# EAGLE design Adafruit MicroLipo (EAGLE 6.3)
AUTHOR: K. TOWNSEND
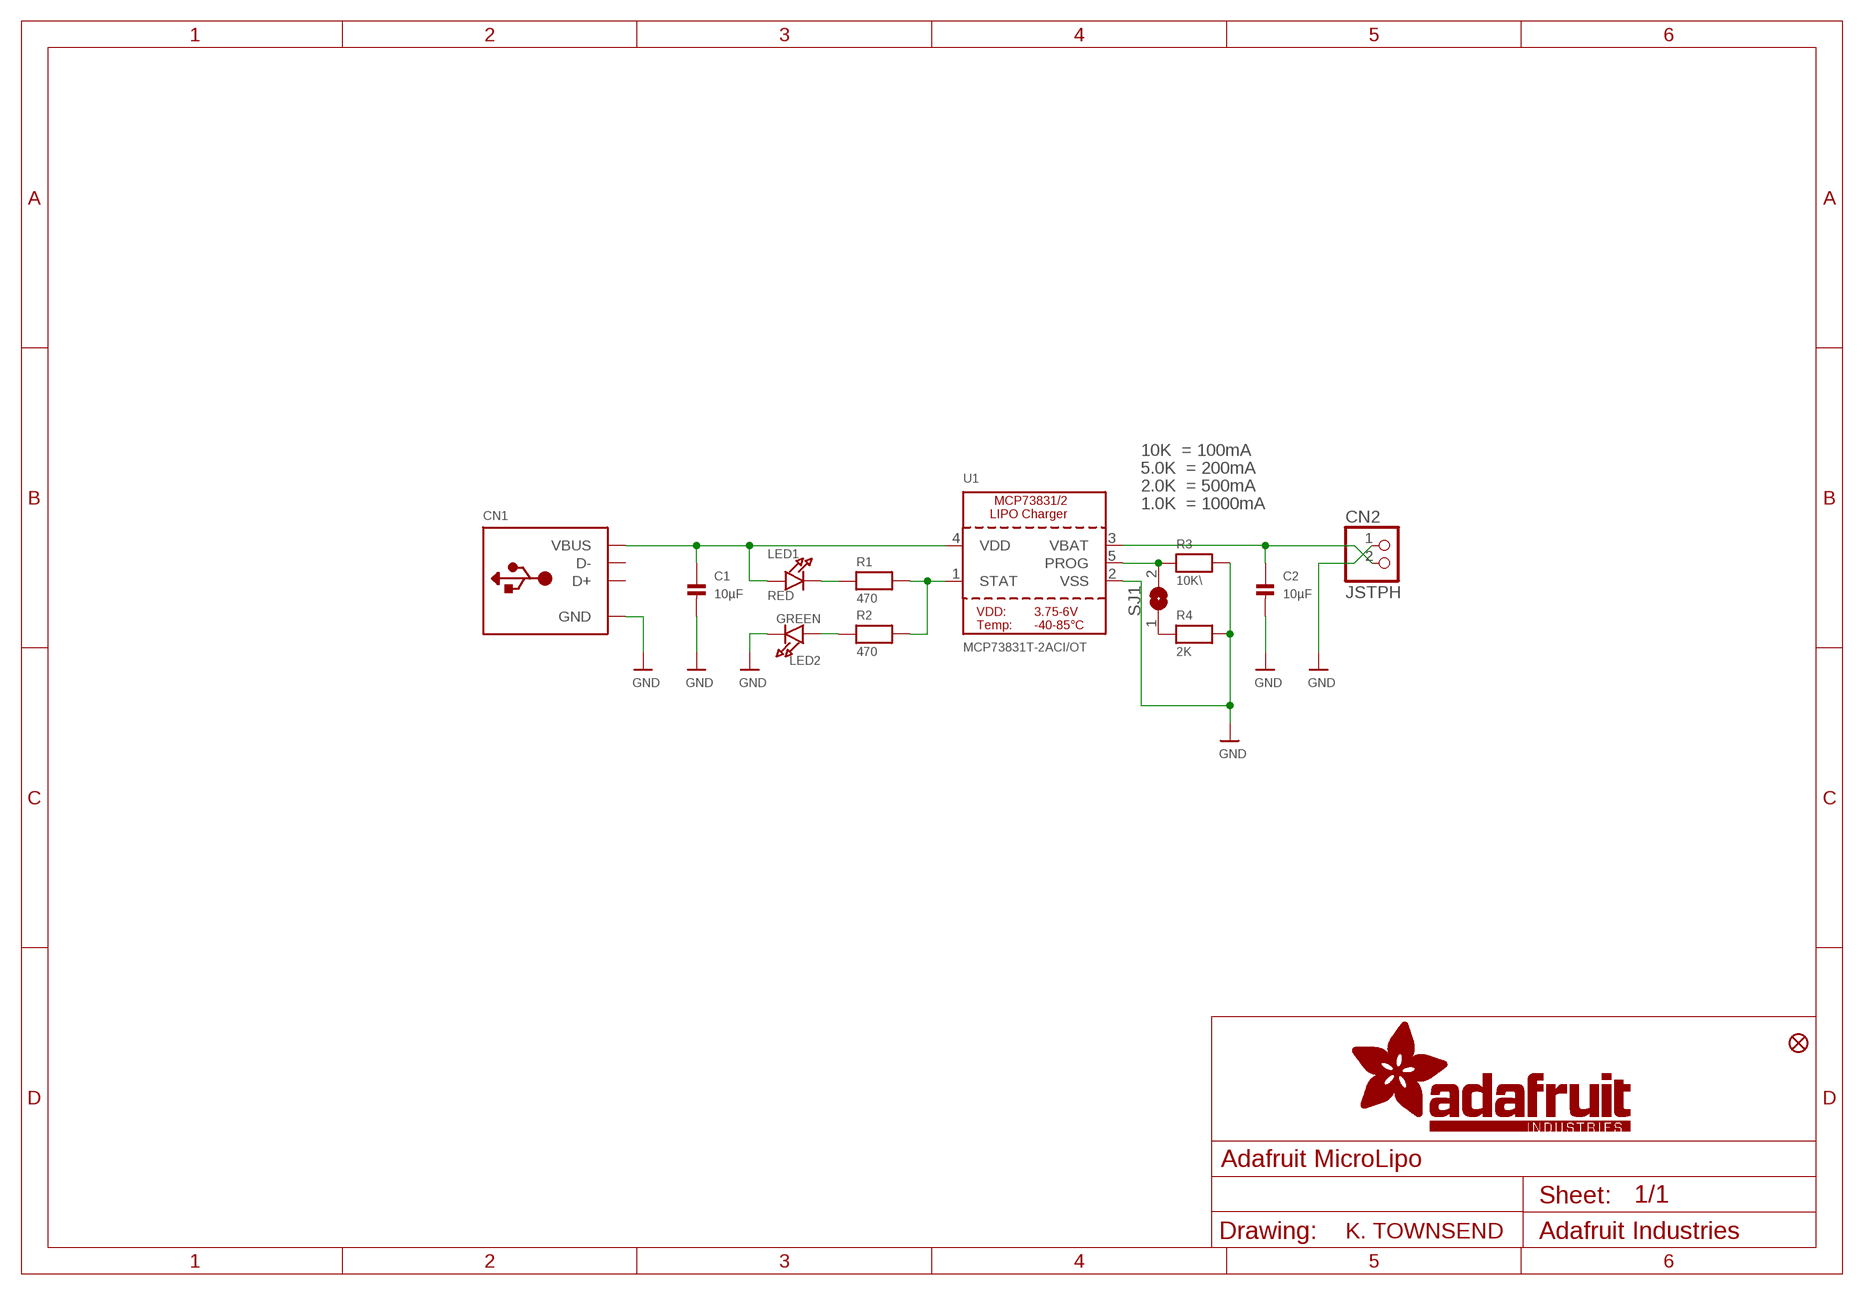
[diagram p0: schematic, sheet 1]

## Parts
C1  10µF  CAP_CERAMIC0805  [0805]
C2  10µF  CAP_CERAMIC0805  [0805]
CN1  USB_TYPEAPCB  [USBA_PCB]
CN2  JSTPH  JST_2PIN  [JSTPH2]
FID1  FIDUCIAL""  [FIDUCIAL_1MM]
LED1  RED  LED0805  [CHIPLED_0805]
LED2  GREEN  LED0805  [CHIPLED_0805]
R1  470  RESISTOR0805  [0805]
R2  470  RESISTOR0805  [0805]
R3  10K\  RESISTOR0805  [0805]
R4  2K  RESISTOR0805  [0805]
SJ1  SOLDERJUMPER  [SOLDERJUMPER_ARROW_NOPASTE]
U1  MCP73831T-2ACI/OT  MCP73831/2  [SOT23-5]

## Nets
GND: C1.2 C2.2 CN1.GND CN2.1 LED2.C R3.2 R4.2 U1.2(VSS)
N$1: LED1.C R1.1
N$2: R1.2 R2.2 U1.1(STAT)
N$3: R4.1 SJ1.1
N$5: R3.1 SJ1.2 U1.5(PROG)
N$6: LED2.A R2.1
VBAT: C2.1 CN2.2 U1.3(VBAT)
VDD: C1.1 CN1.VCC(VBUS) LED1.A U1.4(VDD)
Unconnected: CN1.USB_NEG(D-) CN1.USB_PLUS(D+)

## Notes on the sheet
- 10K  = 100mA
- 5.0K  = 200mA
- 2.0K  = 500mA
- 1.0K  = 1000mA

## Library data of the parts
C1 C2 = microbuilder:CAP_CERAMIC: Ceramic Capacitors 0402 - 0402 Surface Mount Capacitors 16pF 50V 5% [Digikey: 445-4899-2-ND] 18pF 50V 5% [Digikey: 490-1281-2-ND] 22pF 50V 5% [Digikey: 490-1283-2-ND] 68pF 50V 5% [Digikey: 490-1289-2-ND] 0.1uF 10V 10% [Digikey: 490-1318-2-ND] 1.0uF 6.3V 10% [Digikey: 490-1320-2-ND] 0603 - 0603 Surface Mount Capacitors 16 pF 50V 5% [Digikey: 445-5051-2-ND] 22 pF 50V [Digikey: PCC220ACVTR-ND] 33 pF 50V 5% [Digikey: 490-1415-1-ND] 56pF 50V 5% [Digikey: 490-1421-1-ND] 220pF 50V 5% [Digikey: 445-1285-1-ND] 680 pF 50V 2200 pF 50V 5% C0G [Digikey: 445-1297-1-ND] 5600 pF 100V 5% X7R [Digikey: 478-3711-1-ND] 0.1 µF 25V 10% [Digikey: PCC2277TR-ND] 0.22 µF 16V 10% X7R [Digikey: 445-1318-1-ND] 1.0 µF 25V 10% [Digikey: 445-5146-2-ND] 0603 - RF Specific 3pF 250V +/-0.1pF RF [Digikey: 712-1347-1-ND] 18 pF 250V 5% [Digikey: 478-3505-1-ND or 712-1322-1-ND] 56 pF 250V 5% C0G RF [Digikey: 490-4867-1-ND] 68 pF 250V RF [Digikey: 490-4868-1-ND] 0805 - 0805 Surface Mount Capacitors 220 pF 250V 2% RF Ceramic Capacitor [Digikey: 712-1398-1-ND] 1000 pF 50V 2% NP0 Ceramic Capacitor [Digikey: 478-3760-1-ND] 0.1 µF 25V 10% Ceramic Capacitor [Digikey: PCC1828TR-ND] 1.0 µF 16V 10% Ceramic Capacitor[Digikey: 490-1691-2-ND] 10.0 µF 10V 10% Ceramic Capacitor[Digikey: 709-1228-1-ND] 10.0 uF 16V 10% Ceramic Capacitor [Digikey: 478-5165-2-ND] 47 uF 6.3V 20% Ceramic Capacitor [Digikey: 587-1779-1-ND or 399-5506-1-ND] 1206 - 1206 Surface Mount Capacitors 47uF 10V 20% Ceramic Capacitor [Digikey: 490-5528-1-ND or 399-5508-1-ND or 445-6010-1-ND] 100uF 6.3V -20%, +80% Y5V Ceramic Capacitor (Digikey: 490-4512-1-ND, Mouser: 81-GRM31CF50J107ZE1L)
CN1 = microbuilder:USB_TYPEA: USB - Type A Connectors Male types stick out and are inserted into a PC or matching females parts (these are the connectors used on USB Memory Sticks, etc.). Female parts are generally used for USB Host and accept a male-type connector. SMT Male - 4UCON: 10017 PTH Female - Digikey: 609-1045-ND, 4UCon: 05241
CN2 = microbuilder:JST_2PIN: JST 2-Pin Right-Angle Connector PH-Series - 4UConnector: 17311 SH-Series - 4UConnector: 07278
FID1 = microbuilder:FIDUCIAL: Fiducial Alignment Points Various fiducial points for machine vision alignment.
LED1 LED2 = microbuilder:LED: LED 0603 - 0603 Surface Mount Package 2mA: Green LED - Low Power (3.9mcd, 2ma, 1.7Vf) - Digikey: 475-2709-2-ND Orange LED - Low Power (9.8mcd, 2ma, 1.8Vf) - Digikey: 475-1194-2-ND Red LED - Low Power (5mcd, 2ma, 1.8Vf) - Digikey: 475-1195-2-ND Yellow LED - Low Power (7mcd, 2ma, 1.8Vf) - Digikey: 475-1196-2-ND 5mA: Blue LED - Low Power (17mcd, 5ma, 2.9Vf) - Digikey: LNJ937W8CRACT-ND 0805 - 0805 Surface Mount Package 2mA: Red LED (8.8mcd, 2mA, 1.8Vf, Clear) - Low Power [Digikey: 475-2510-1-ND] Green LED (5mcd, 2mA, 1.8Vf, Clear) - Low Power [Digikey: 475-2730-1-ND] Yellow LED (11.3mcd, 2mA, 1.8Vf, Clear) - Low Power [Digikey: 475-2555-1-ND] 20mA: Red LED (104mcd, 20mA, Diffused) - LS R976 [Digikey: 475-1278-6-ND] Red LED (12mcd, 20mA, 2.0Vf, Clear) - APT2012EC [Digikey: 754-1128-1-ND] Green LED (15mcd, 20mA, 2.2Vf, Clear) - APT2012GC [Digikey: 754-1131-1-ND] Orange LED (160mcd, 20mA, 2.1Vf, Clear) - APT2012SECK [Digikey: 754-1130-1-ND] 1206 - 1206 Surface Mount Package Green LED (26mcd, 20mA, Diffused) - LG N971 [Digikey: 475-1407-6-ND] Red LED (15mcd, 20mA, Diffused) - LH N974 [Digikey: 475-1416-6-ND] Cree - Cree High-Power Surface Mount LEDs XPEBWT-L1-0000-00D50 - White 111lm 350mA 2.9Vf 6200K 110° XTEAWT-00-0000-00000LEE3 - White 114lm 350mA 2.85Vf 5000K 115°
R1-R4 = microbuilder:RESISTOR: Resistors 0402 - 0402 Surface Mount Package 22 Ohm 1% 1/16W [Digikey: 311-22.0LRTR-ND] 33 Ohm 5% 1/16W 1.0K 5% 1/16W 1.5K 5% 1/16W 2.0K 1% 1/16W 10.0K 1% 1/16W [Digikey: 311-10.0KLRTR-ND] 10.0K 5% 1/16W [Digikey: RMCF0402JT10K0TR-ND] 12.1K 1% 1/16W [Digikey: 311-22.0LRTR-ND] 100.0K 5% 1/16W 0603 - 0603 Surface Mount Package 0 Ohm 1/10 Watt 1% Resistor 15 Ohm 1/10 Watt 1% Resistor 33 Ohm 1/10 Watt 1% Resistor 49.9 Ohm 1/10 Watt 1% Resistor 100 Ohm 1/10 Watt 1% Resistor 150 Ohm 1/10 Watt 1% Resistor 240 Ohm 1/10 Watt 1% Resistor 390 Ohm 1/10 Watt 1% Resistor 560 Ohm 1/10 Watt 1% Resistor 680 Ohm 1/10 Watt 1% Resistor 750 Ohm 1/10 Watt 1% Resistor 1.0K Ohm 1/10 Watt 1% Resistor 1.5K Ohm 1/10 Watt 1% Resistor 2.0K Ohm 1/10 Watt 1% Resistor 2.2K Ohm 1/10 Watt 1% Resistor 3.3K Ohm 1/10 Watt 1% Resistor 4.7K Ohm 1/10 Watt 1% Resistor 10.0K Ohm 1/10 Watt 1% Resistor 12.0K Ohm 1/10 Watt 1% Resistor 12.1K Ohm 1/10 Watt 1% Resistor 20.0K Ohm 1/10 Watt 1% Resistor 33.0K Ohm 1/10 Watt 1% Resistor 100.0K Ohm 1/10 Watt 1% Resistor 0805 - 0805 Surface Mount Package 0 Ohm 1/8 Watt 1% Resistor 33 Ohm 1/8 Watt 1% Resistor 100 Ohm 1/8 Watt 1% Resistor 150 Ohm 1/8 Watt 1% Resistor 200 Ohm 1/8 Watt 1% Resistor 240 Ohm 1/8 Watt 1% Resistor 330 Ohm 1/8 Watt 1% Resistor 390 Ohm 1/8 Watt 1% Resistor 470 Ohm 1/8 Watt 1% Resistor 1.0K Ohm 1/8 Watt 1% Resistor 1.5K Ohm 1/8 Watt 1% Resistor 2.0K Ohm 1/8 Watt 1% Resistor 4.7K Ohm 1/8 Watt 1% Resistor 5.1K Ohm 1/8 Watt 1% Resistor 5.6K Ohm 1/8 Watt 1% Resistor 10.0K Ohm 1/8 Watt 1% Resistor 22.0K Ohm 1/8 Watt 1% Resistor 33.0K Ohm 1/8 Watt 1% Resistor 100K Ohm 1/8 Watt 1% Resistor 1206 - 1206 Surface Mount Package 2012 - 2010 Surface Mount Package 0.11 Ohm 1/2 Watt 1% Resistor - Digikey: RHM.11UCT-ND
SJ1 = microbuilder:SOLDERJUMPER: SMD Solder JUMPER Solder the two pads together to create a connection, or remove the solder to break it. REFLOW - Use this footprint for solder paste and reflow ovens. WAVE - Use this footprint for hand-soldering (larger pads). CLOSED - Has a trace between the two pads to ensure it is closed by default. The trace needs to be cut to disable the jumper, and can be closed again by creating a solder bridge between the two pads.; BOM: EXCLUDE
U1 = microbuilder:MCP73831/2: MCP73831/2 LIPO Charger VDD: 3.75 - 6V Temp -40 - 85°C Programmable Charge Rate: 15-500mA NOTE: STAT is a tri-state logic output on the MCP73831 and an open-drain output on the MCP73832. SOT23-5 with 4.2V output and tri-state logic on STAT = MCP73831T-2ACI/OT

## Board
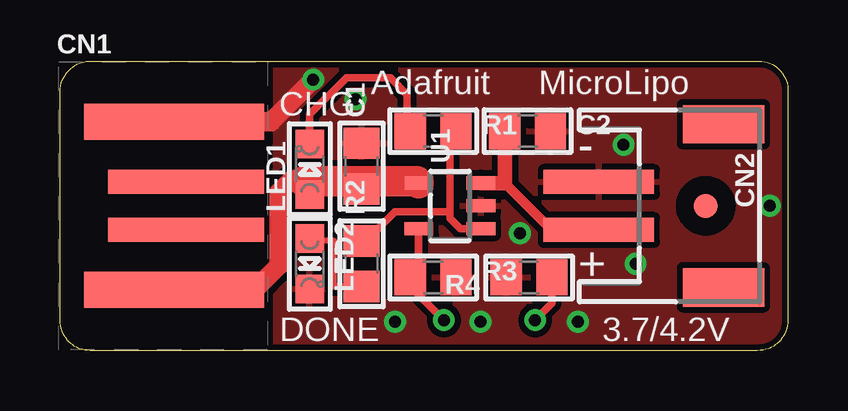
[diagram p1: board, top side]
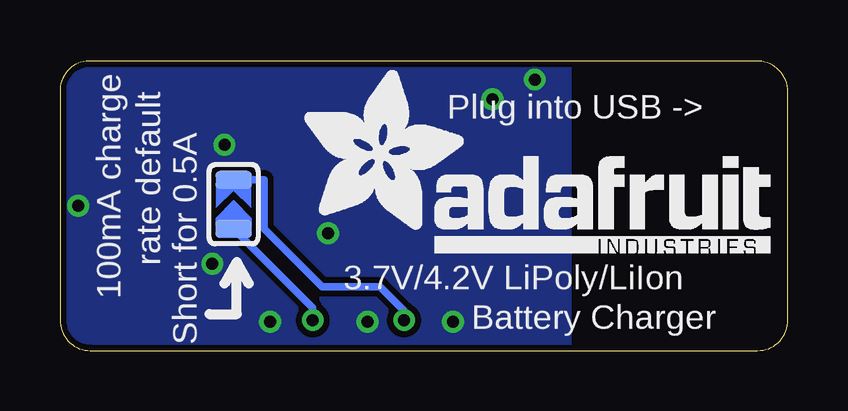
[diagram p2: board, bottom side, seen from below]

Size 30.35 x 12.06 mm. Coordinates in mm from the lower left corner, seen from the top.
Outline: 0,10.79 arc-90 1.33,12.06 29.15,12.06 arc-90 30.35,10.79 30.35,1.27 arc-90 29.08,0 1.27,0 arc-90 0,1.27 0,10.79
Copper layers (1*16): Top 0.035mm / dielectric 1.5mm / Bottom 0.035mm
Design rules "adafruit": minimum track width 8mil, minimum drill 16mil, track to track 8mil, track to pad 8mil, pad to pad 8mil, via to via 8mil, smd to smd 8mil, copper to edge 10mil, drill to drill 8mil, minimum pad ring 10mil, minimum via ring 8mil, stop-mask expansion 4mil, vias tented up to drill 20mil, thermal gap 10mil

### Footprints (pad centres in the part's own frame; a part is rotated, then mirrored left to right if it is on the bottom)
0805 = smd 1.3 x 1.5: 1 -0.95,0; 2 0.95,0
USBA_PCB = smd 7.5 x 1.5: GND -0.2,3.5; VCC -0.2,-3.5 | smd 6.5 x 1: USB_NEG 0.3,-1; USB_PLUS 0.3,1
JSTPH2 = smd 1 x 4.6: 1 -1,-3.7; 2 1,-3.7 | smd 1.6 x 3.4: NC1 -3.4,1.5; NC2 3.4,1.5
FIDUCIAL_1MM = smd 1 x 1: 1 0,0
CHIPLED_0805 = smd 1.2 x 1.2: A 0,-1.05; C 0,1.05
SOLDERJUMPER_ARROW_NOPASTE = smd 0.762 x 1.524: 1 -1.016,0; 2 1.016,0
SOT23-5 = smd 0.55 x 1.2: 1 -0.95,-1.3; 2 0,-1.3; 3 0.95,-1.3; 4 0.95,1.3; 5 -0.95,1.3

### Placement (x,y rotation side)
C1  12.57,7.68 90 top
C2  19.49,9.14 0 top
CN1  4.95,6.03 0 top
CN2  26.16,6.03 270 top
FID1  26.92,6.03 0 top
LED1  10.41,7.56 0 top
LED2  10.41,3.62 180 top
R1  15.56,9.14 0 top
R2  12.57,3.62 90 top
R3  15.56,3.05 0 top
R4  19.56,3.05 180 top
SJ1  23.11,6.1 90 bottom
U1  16.26,6.03 90 top
U$8  [ADAFRUIT_TEXT_20MM]  20.32,4.06 0 bottom

### Tracks (layer width: path | path; a pad name or v marks a point on that pad's centre or on a via)
GND  (via drill 0.5)
  Top 0.813: CN1.GND 8.8,9.53 v10.56,11.29
  other vias: 23.5,8.57 12.32,10.48 24,3.62 29.59,6.03 17.53,1.21 21.59,1.21 13.97,1.21 19.18,4.89
  pour Top (isolate 0.254): 9.02,-0.06 9.02,12.13 30.35,12.13 30.35,-0.06
  pour Bottom (isolate 0.254): 9.14,12.06 30.35,12.06 30.35,0 9.14,0
N$1
  Top 0.305: LED1.C 10.41,9.84 11.94,11.37 13.78,11.37 14.48,10.67 14.48,9.27 R1.1
N$2
  Top 0.305: R1.2 16.26,8.89 16.26,5.78 | 16.26,5.78 16.26,5.52 16.7,5.08 U1.1 | 16.26,5.78 13.97,5.78 12.76,4.57 R2.2
N$3  (via drill 0.5)
  Top 0.305: R4.1 20.51,1.97 v19.81,1.27
  Bottom 0.305: v19.81,1.27 19.81,1.78 SJ1.1
N$5  (via drill 0.5)
  Top 0.305: U1.5 14.96,3.52 | v16,1.27 14.61,2.66
  Top 0.406: 14.61,2.66 R3.1 14.96,3.4 14.96,3.52
  Bottom 0.305: SJ1.2 21.84,7.11 21.84,5.08 19.43,2.67 17.02,2.67 16,1.65 v16,1.27
N$6
  Top 0.254: R2.1 11.43,2.67 11.43,4.57 10.41,4.57 LED2.A
VBAT
  Top 0.406: CN2.2 20.49,5.03 18.54,6.98
  Top 0.61: U1.3 18.54,6.98 C2.1
VDD
  Top 0.254: 10.19,7.01 10.16,7.05 | C1.1 10.51,6.73
  Top 0.305: 10.51,6.73 10.51,6.61 LED1.A 10.41,6.79 10.19,7.01
  Top 0.813: CN1.VCC 8.12,2.53 9.14,3.56 9.14,6.6 9.65,7.11 10.1,7.11 10.16,7.05
  Top 1.27: 10.16,7.05 14.89,7.05 U1.4

### Text on the board
tPlace: Adafruit | MicroLipo | CHG | - | + | DONE | 3.7/4.2V
bPlace: 100mA charge | rate default | Plug into USB -> | 3.7V/4.2V LiPoly/LiIon | Battery Charger | Short for 0.5A